# Altium schematic sheet 2_Power.schdoc
size 302 x 215 mm; Name: A_A4; Symbol: A_A4; Device: A_A4; @Project Name: ESP32-C3 module_2024-02-14_10-07-03; REV: 1.0.1; Date: 2025-07-01; Sheet: 2/2; Draw By: Konstantinos Paraskevas; Company: Konstantinos Paraskevas; Convert to PCB: yes; Add into BOM: yes; @Page No: 2; @Page Count: 2; @Schematic Name: Sprig-C3; @Board Name: Sprig-C3; @Update Date: 2025-12-17; @Create Time: 10:07:06; @Update Time: 20:19:13; @Page Name: Power; @Create Date: 2024-02-14
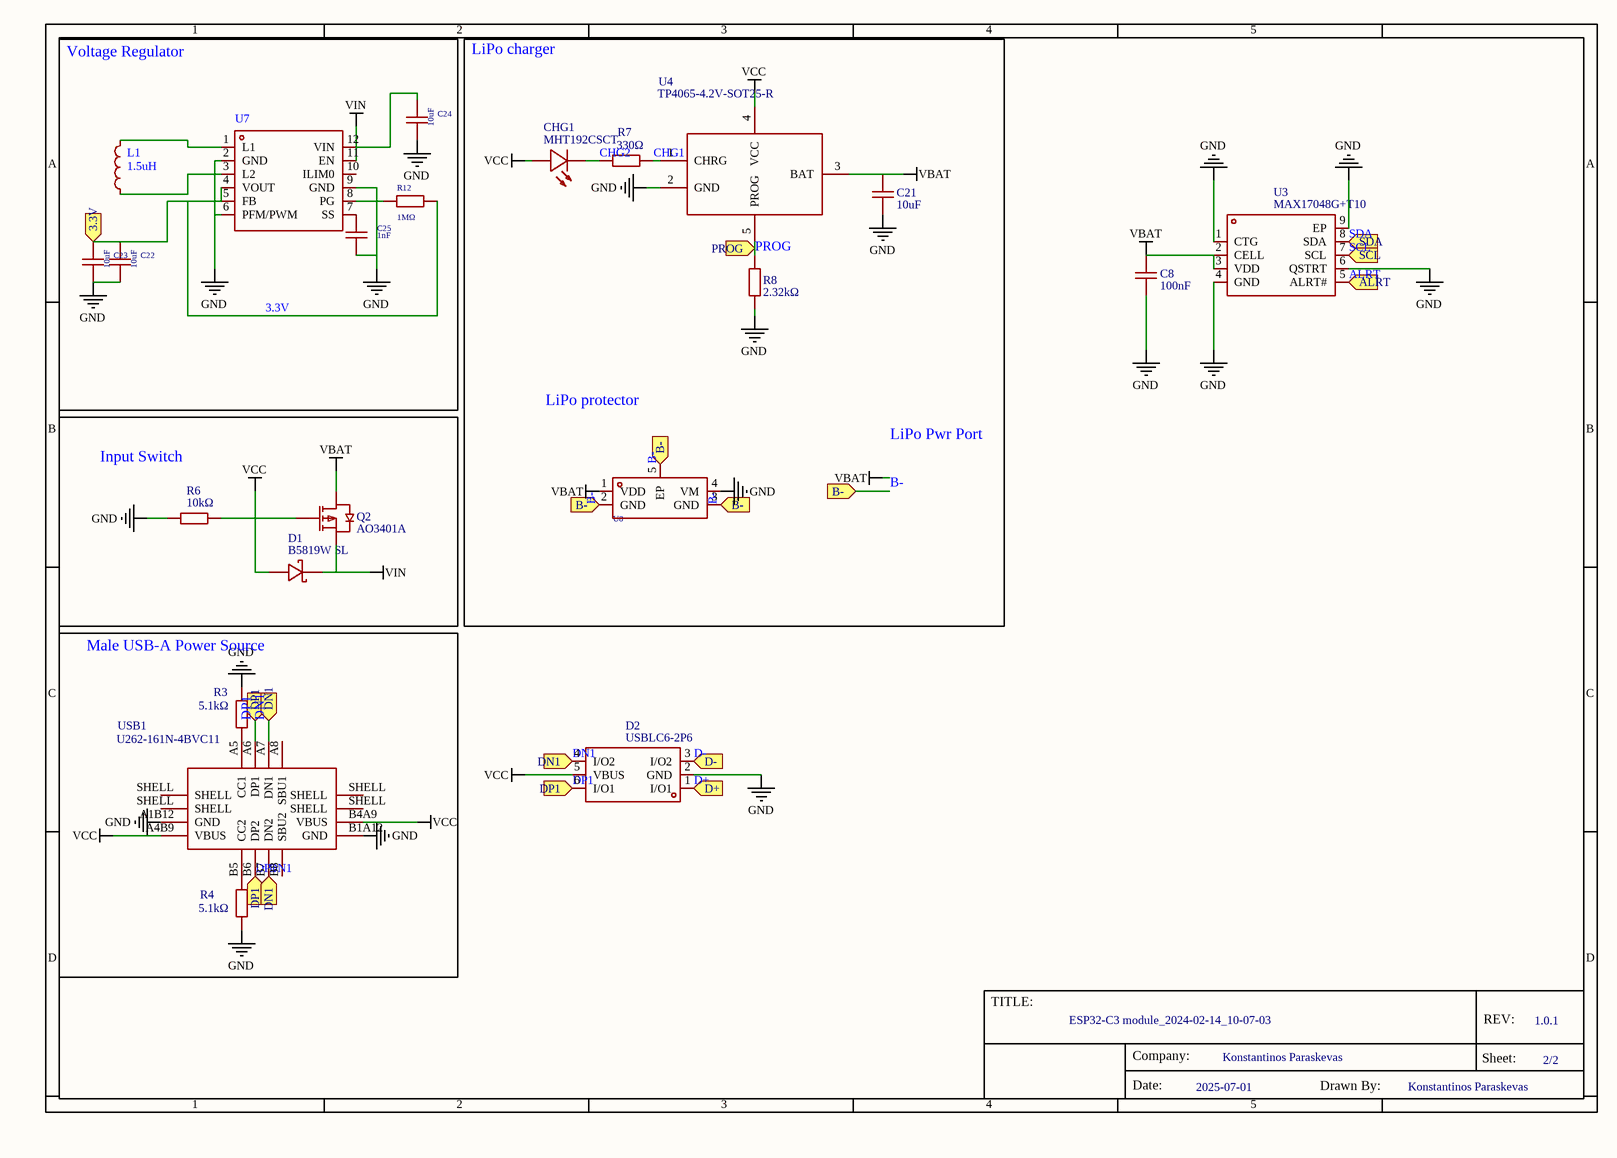
[diagram p0: 2_Power.schdoc]

## Parts
C8  100nF  [C0402]
C21  10uF  [C0402]
C22  10uF  [C0402]
C23  10uF  [C0402]
C24  10uF  [C0402]
C25  1nF  [C0402]
CHG1  MHT192CSCT  [LED0603-R-RD_ORANGE]
D1  B5819W SL  [SOD-123_L2.7-W1.6-LS3.7-RD-1]
D2  USBLC6-2P6  [SOT-666-6_L1.6-W1.2-P0.50-LS1.6-BL]
L1  1.5uH  [L0806]
Q2  AO3401A  [SOT-23_L2.9-W1.3-P1.90-LS2.4-BR]
R3  5.1kΩ  [R0402]
R4  5.1kΩ  [R0402]
R6  10kΩ  [R0402]
R7  330Ω  [R0402]
R8  2.32kΩ  [R0402]
R12  1MΩ  [R0402]
U3  MAX17048G+T10  [DFN-8_L2.0-W2.0-P0.50-BL-EP]
U4  TP4065-4.2V-SOT25-R  [SOT-23-5_L3.0-W1.7-P0.95-LS2.8-BR]
U7  TPS63051RMWR  [QFN-12_L2.5-W2.5-P0.50-TL]  (value not drawn)
U8  AP6683  [DFN-4_L1.0-W1.0-P0.65-BL-EP]  (value not drawn)
USB1  U262-161N-4BVC11  [USB-3.1-SMD_U262-161N-4BVC11]

## Blocks framed on the sheet
Voltage Regulator: C22-C25 L1 R12 U7
Input Switch: D1 Q2 R6
Male USB-A Power Source: R3 R4 USB1

## Ports
3.3V (in), ALRT (in), B- (in), D+ (in), D- (in), DN1 (in), DP1 (in), PROG (in), SCL (in), SDA (in)

## Nets
GND: C8.1 C21.1 C22.1 C23.1 C24.1 C25.1 D2.2(GND) R3.2 R4.1 R6.1 R8.1 U3.1(CTG) U3.4(GND) U3.6(QSTRT) U3.9(EP) U4.2(GND) U7.2(GND) U7.6(PFM/PWM) U7.9(GND) U8.4(VM) USB1.A1B12(GND) USB1.B1A12(GND)
VBAT: C8.2 C21.2 Q2.3(D) U3.2(CELL) U3.3(VDD) U4.3(BAT) U8.1(VDD)
VCC: CHG1.1(A) D1.2(+) D2.5(VBUS) Q2.1(G) R6.2 U4.4(VCC) USB1.A4B9(VBUS) USB1.B4A9(VBUS)
VIN: C24.2 D1.1(-) Q2.2(S) U7.11(EN) U7.12(VIN)
3.3V: C22.2 C23.2 R12.2 U7.4(VOUT) U7.5(FB) ; port 3.3V
ALRT: U3.5(ALRT#) ; port ALRT
B-: U8.2(GND) U8.3(GND) U8.5(EP) ; port B-
CHG1: R7.2 U4.1(CHRG)
CHG2: CHG1.2(K) R7.1
D+: D2.1(I/O1) ; port D+
D-: D2.3(I/O2) ; port D-
DN1: D2.4(I/O2) USB1.A7(DN1) USB1.B7(DN2) ; port DN1
DP1: D2.6(I/O1) USB1.A6(DP1) USB1.B6(DP2) ; port DP1
PROG: R8.2 U4.5(PROG) ; port PROG
SCL: U3.7(SCL) ; port SCL
SDA: U3.8(SDA) ; port SDA
NetC25_2: C25.2 U7.7(SS)
NetL1_1: L1.1 U7.3(L2)
NetL1_2: L1.2 U7.1(L1)
NetR3_1: R3.1 USB1.A5(CC1)
NetR4_2: R4.2 USB1.B5(CC2)
NetR12_1: R12.1 U7.8(PG)

Not connected (* = marked no-connect by the designer): U7 10(ILIM0); USB1 A8(SBU1) B8(SBU2) SHELL

## Notes on the sheet
- LiPo charger
- LiPo protector
- LiPo Pwr Port
- 1
- 2
- 3
- 4
- 5
- A
- B
- C
- D
- TITLE:
- ESP32-C3 module_2024-02-14_10-07-03
- REV:
- 1.0.1
- Date:
- Company:
- 2025-07-01
- Konstantinos Paraskevas
- Drawn By:
- Sheet:
- 2/2

## Library data of the parts
C8 = 0402B104K160NT: Manufacturer: FH(风华); Add into BOM: yes; Tolerance: ±10%; Symbol: 100nF; Device: 0402B104K160NT; LCSC Part Name: 100nF ±10% 16V; Supplier Part: C41851; Manufacturer Part: 0402B104K160NT; Supplier Footprint: 0402; JLCPCB Part Class: Extended Part; Datasheet: https://atta.szlcsc.com/upload/public/pdf/source/20200305/C486355_26A10D38EF8C2A5C37091D0039909270.pdf; Supplier: LCSC; Convert to PCB: yes; Value: 100nF; Origin Footprint: C0402
C21-C24 = CL05A106MQ5NUNC: Manufacturer: SAMSUNG(三星); Add into BOM: yes; Tolerance: ±20%; Device: CL05A106MQ5NUNC; LCSC Part Name: 10uF ±20% 6.3V; Supplier Part: C15525; Manufacturer Part: CL05A106MQ5NUNC; Supplier Footprint: 0402; JLCPCB Part Class: Basic Part; Datasheet: https://atta.szlcsc.com/upload/public/pdf/source/20220823/2B02EE04F8F211D38A52DCB16EB6BEBA.pdf; Supplier: LCSC; Convert to PCB: yes; Value: 10uF
  C21: Symbol: 10uF; Origin Footprint: C0402
  C22-C24: Symbol: CL05A106MQ5NUNC
C25 = CC0402KRX7R9BB102: Manufacturer: YAGEO(国巨); Add into BOM: yes; Tolerance: ±10%; Symbol: CC0402KRX7R9BB102; Device: CC0402KRX7R9BB102; LCSC Part Name: 1nF ±10% 50V; Supplier Part: C106205; Manufacturer Part: CC0402KRX7R9BB102; Supplier Footprint: 0402; JLCPCB Part Class: Extended Part; Datasheet: https://atta.szlcsc.com/upload/public/pdf/source/20181008/C309510_22F155564471FAF6A489F7D68F34234E.pdf; Supplier: LCSC; Convert to PCB: yes; Value: 1nF
CHG1 = MHT192CSCT: Manufacturer: MEIHUA(美华); Add into BOM: yes; Emitted Color: Orange; Power Dissipation: 60mW; Forward Current: 20mA; Dominant Wavelength: 597.5nm~609.5nm; Peak Wavelength: 611nm; Lens Color: 无色透明透镜; Viewing Angle: 120°; Symbol: MHT192CSCT; Device: MHT192CSCT; LCSC Part Name: 橙灯; Supplier Part: C401116; Manufacturer Part: MHT192CSCT; Supplier Footprint: 0603; JLCPCB Part Class: Extended Part; Datasheet: https://atta.szlcsc.com/upload/public/pdf/source/20190702/C401116_352EE2AFCDF8A648729C25765353F625.pdf; Supplier: LCSC; Convert to PCB: yes; Diode Configuration: -; Color Temperature: -; Mounting Sytle: -; Operating Temperature: -35℃~+85℃; Origin Footprint: LED0603-R-RD_ORANGE
D1 = B5819W SL: Manufacturer: CJ(江苏长电/长晶); Symbol: B5819W_C8598; Add into BOM: yes; Forward Voltage (Vf@If): 600mV@1A; Reverse Voltage (Vr): 40V; Average Rectified Current (Io): 1A; Device: B5819W SL; LCSC Part Name: 电压:40V 电流:1A; Supplier Part: C8598; Manufacturer Part: B5819W SL; Supplier Footprint: SOD-123; JLCPCB Part Class: Basic Part; Datasheet: https://atta.szlcsc.com/upload/public/pdf/source/20171228/C164911_15144413243851213914.pdf; Supplier: LCSC; Convert to PCB: yes; Origin Footprint: SOD-123_L2.7-W1.6-LS3.7-RD-1
D2 = USBLC6-2P6: Manufacturer: TECH PUBLIC(台舟); Symbol: USBLC6-2P6_C2827693; Add into BOM: yes; Type: ESD; Device: USBLC6-2P6; LCSC Part Name: MSL=3; Supplier Part: C2827693; Manufacturer Part: USBLC6-2P6; Supplier Footprint: SOT-666-6; JLCPCB Part Class: Extended Part; Datasheet: https://atta.szlcsc.com/upload/public/pdf/source/20210810/36353A9194EA9F4E33F8AE18BE051AEA.pdf; Supplier: LCSC; Convert to PCB: yes; Origin Footprint: SOT-666-6_L1.6-W1.2-P0.50-LS1.6-BL
L1 = DFE201610E-1R5M=P2: Manufacturer: muRata(村田); Add into BOM: yes; Tolerance: ±20%; Symbol: DFE201610E-1R5M=P2; Device: DFE201610E-1R5M=P2; LCSC Part Name: 1.5uH ±20%; Supplier Part: C668311; Manufacturer Part: DFE201610E-1R5M=P2; Supplier Footprint: 0806; JLCPCB Part Class: Extended Part; Datasheet: https://atta.szlcsc.com/upload/public/pdf/source/20190513/C337891_E8F53E7A275D0CF4365E41AA9943B04D.pdf; Supplier: LCSC; Convert to PCB: yes; Value: 1.5uH; Rated Current: -; Saturation Current (Isat): -; DC Resistance (DCR): -; Ratings: -
Q2 = AO3401A_C15127: Manufacturer: AOS; Add into BOM: yes; Drain Source On Resistance (RDS(on)@Vgs,Id): 44mΩ@10V,4.3A; Gate Threshold Voltage (Vgs(th)@Id): 1.3V@250uA; Total Gate Charge (Qg@Vgs): 12.2nC@4.5V; Input Capacitance (Ciss@Vds): 1.2nF@15V; Origin Footprint: SOT-23_L2.9-W1.3-P0.95-LS2.4-BR; Symbol: AO3401A; Device: AO3401A_C15127; LCSC Part Name: P沟道 耐压:30V 电流:4A; Supplier Part: C15127; Manufacturer Part: AO3401A; Supplier Footprint: SOT-23; JLCPCB Part Class: Basic Part; Datasheet: https://atta.szlcsc.com/upload/public/pdf/source/20160507/1462613609053.pdf; Supplier: LCSC; Convert to PCB: yes; Operating Temperature: -55℃~+150℃@(Tj); image: //image.lceda.cn/szlcsc/C15127.jpg
R3 R4 = 0402WGJ0512TCE: Manufacturer: UNI-ROYAL(厚声); Add into BOM: yes; Tolerance: ±5%; Temperature Coefficient: ±100ppm/℃; Resistance: 5.1K; Symbol: 5.1kΩ; Device: 0402WGJ0512TCE; LCSC Part Name: 5.1kΩ ±5% 62.5mW 厚膜电阻; Supplier Part: C25941; Manufacturer Part: 0402WGJ0512TCE; Supplier Footprint: 0402; JLCPCB Part Class: Extended Part; Datasheet: https://atta.szlcsc.com/upload/public/pdf/source/20200306/C422600_1E6D84923E4A46A82E41ADD87F860B5C.pdf; Supplier: LCSC; Convert to PCB: yes; Type: Thick Film Resistors; Value: 5.1kΩ; Operating Temperature Range: -55℃~+155℃; Origin Footprint: R0402
R6 = RMS04FT1002: Manufacturer: 大毅科技; Symbol: 100K; Add into BOM: yes; Tolerance: ±1%; Temperature Coefficient: ±100ppm/℃; Device: RMS04FT1002; LCSC Part Name: 厚膜电阻 10kΩ ±1% 62.5mW; Supplier Part: C208775; Manufacturer Part: RMS04FT1002; Supplier Footprint: 0402; JLCPCB Part Class: Extended Part; Datasheet: https://atta.szlcsc.com/upload/public/pdf/source/20190313/C209057_DB28D2F9A2E1A0AF6BB7AAA99A28D7CC.pdf; Supplier: LCSC; Convert to PCB: yes; Type: Thick Film Resistors; Value: 10kΩ; Operating Temperature Range: -55℃~+155℃; Origin Footprint: R0402
R7 = 0402WGF3300TCE: Manufacturer: UNI-ROYAL(厚声); Symbol: 330; Add into BOM: yes; Tolerance: ±1%; Temperature Coefficient: ±100ppm/℃; Device: 0402WGF3300TCE; LCSC Part Name: 330Ω ±1% 62.5mW 厚膜电阻; Supplier Part: C25104; Manufacturer Part: 0402WGF3300TCE; Supplier Footprint: 0402; JLCPCB Part Class: Basic Part; Datasheet: https://atta.szlcsc.com/upload/public/pdf/source/20200306/C422600_1E6D84923E4A46A82E41ADD87F860B5C.pdf; Supplier: LCSC; Convert to PCB: yes; Type: Thick Film Resistors; Value: 330Ω; Operating Temperature Range: -55℃~+155℃; Origin Footprint: R0402
R8 = WR04X2321FTL: Manufacturer: Walsin(华新科); Symbol: 2K; Add into BOM: yes; Tolerance: ±1%; Temperature Coefficient: ±100ppm/℃; Device: WR04X2321FTL; LCSC Part Name: 厚膜电阻 2.32kΩ ±1% 62.5mW; Supplier Part: C334666; Manufacturer Part: WR04X2321FTL; Supplier Footprint: 0402; JLCPCB Part Class: Extended Part; Datasheet: https://atta.szlcsc.com/upload/public/pdf/source/20191217/C470037_D99261402F77DA8B1D609223749D445A.pdf; Supplier: LCSC; Convert to PCB: yes; Type: Thick Film Resistors; Value: 2.32kΩ; Operating Temperature Range: -55℃~+155℃; Origin Footprint: R0402
R12 = 0402WGF1004TCE: Manufacturer: UNI-ROYAL(厚声); Add into BOM: yes; Tolerance: ±1%; Temperature Coefficient: ±100ppm/℃; Symbol: 0402WGF1004TCE; Device: 0402WGF1004TCE; Supplier: LCSC; Manufacturer Part: 0402WGF1004TCE; Supplier Part: C26083; Value: 1MΩ; JLCPCB Part Class: Basic Part; LCSC Part Name: 1MΩ ±1% 62.5mW 厚膜电阻; Supplier Footprint: 0402; Datasheet: https://atta.szlcsc.com/upload/public/pdf/source/20200306/C422600_1E6D84923E4A46A82E41ADD87F860B5C.pdf; Convert to PCB: yes; Type: Thick Film Resistors; Operating Temperature Range: -55℃~+155℃
U3 = MAX17048G+T10: Manufacturer: ADI(亚德诺)/MAXIM(美信); Add into BOM: yes; The Chip Type: 电池监测芯片; Type of Battery: 锂离子/Polymer; Number of Cells: 1; Symbol: MAX17048G+T10; Device: MAX17048G+T10; LCSC Part Name: MAX17048G+T10; Supplier Part: C2682616; Manufacturer Part: MAX17048G+T10; Supplier Footprint: DFN-8-EP(2x2); JLCPCB Part Class: Extended Part; Datasheet: https://atta.szlcsc.com/upload/public/pdf/source/20210106/C2682616_818568B5D3BA4B627110FCAA33E0BFB1.pdf; Supplier: LCSC; Convert to PCB: yes; Operating Temperature: -20℃~+70℃; Origin Footprint: DFN-8_L2.0-W2.0-P0.50-BL-EP; link: https://lcsc.com/eda_search?q=C2682616&amp;%26type=1&amp;ref=editor
U4 = TP4065-4.2V-SOT25-R: Manufacturer: TOPPOWER(南京拓微); Symbol: TP4065; Add into BOM: yes; Device: TP4065-4.2V-SOT25-R; LCSC Part Name: TP4065-4.2V-SOT25-R; Supplier Part: C113540; Manufacturer Part: TP4065-4.2V-SOT25-R; Supplier Footprint: SOT-23-5; JLCPCB Part Class: Extended Part; Datasheet: https://atta.szlcsc.com/upload/public/pdf/source/20170601/1496302453692.pdf; Supplier: LCSC; Convert to PCB: yes; Origin Footprint: SOT-23-5_L3.0-W1.7-P0.95-LS2.8-BR
U7 = TPS63051RMWR: Manufacturer: TI(德州仪器); Add into BOM: yes; Function: Buck-boost type; Output Type: Fixed; Input Voltage: 2.5V~5.5V; Output Voltage: 3.3V; Output Current (Max): 500mA; Switching Frequency: 2.5MHz; Number of Outputs: 1; Topology: Step-down-Boost; Switch tube (built-in/external): 内置; Symbol: TPS63051RMWR; Device: TPS63051RMWR; LCSC Part Name: TPS63051RMWR; Supplier Part: C139412; Manufacturer Part: TPS63051RMWR; Supplier Footprint: QFN-12(2.5x2.5); JLCPCB Part Class: Extended Part; Datasheet: https://www.ti.com/cn/lit/gpn/tps63051; Supplier: LCSC; Convert to PCB: yes; Operating Temperature: -40℃~+85℃@(TA); Synchronous Rectification: Yes
U8 = AP6683: Manufacturer: ALLPOWER(铨力); Add into BOM: yes; Symbol: AP6683; Device: AP6683; Supplier: LCSC; Supplier Part: C2849565; Manufacturer Part: AP6683; JLCPCB Part Class: Extended Part; LCSC Part Name: AP6683; Supplier Footprint: DFN-4-EP(1x1); Datasheet: https://atta.szlcsc.com/upload/public/pdf/source/20210723/C2849565_EA604836CC73D2108C5387801D1EBC6A.pdf; Convert to PCB: yes
USB1 = U262-161N-4BVC11: Manufacturer: XKB Connectivity(中国星坤); Symbol: U262-16XN-4BVC11; Add into BOM: yes; Connector Type: Type-C; Gender: Female; Number of Ports: 1; Number of Contacts: 16P; Current Rating - Power (Max): 3A; Soldering Temperature(Max): 260℃; Device: U262-161N-4BVC11; LCSC Part Name: Type-C 母 卧贴; Supplier Part: C319148; Manufacturer Part: U262-161N-4BVC11; Supplier Footprint: SMD; JLCPCB Part Class: Extended Part; Datasheet: https://atta.szlcsc.com/upload/public/pdf/source/20211015/B478CBA0F1623DA36A6CC6918C49C838.pdf; Supplier: LCSC; Convert to PCB: yes; Standard: USB 3.1; Mounting Style: 卧贴; Contact Material: Copper Alloy; Contact Plating: Gold; Operating Temperature Range: -40℃~+85℃; Origin Footprint: USB-3.1-SMD_U262-161N-4BVC11